# Altium project TIDA_00620.PrjPcb (part 5 of 8)
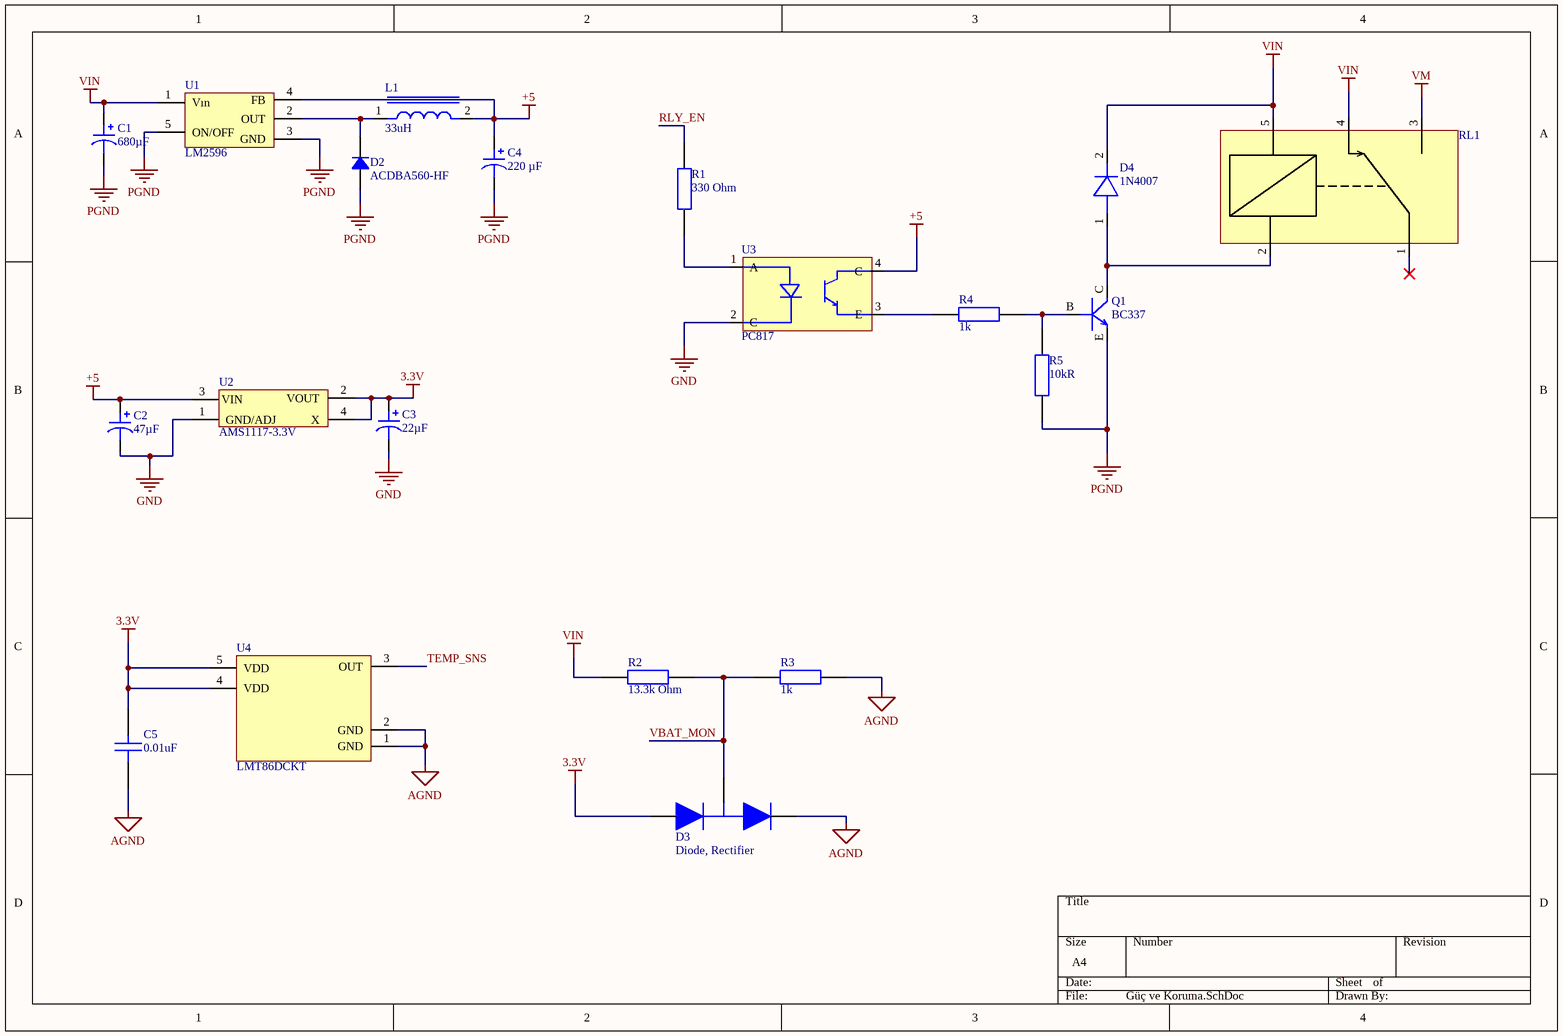
[diagram p8: Güç ve Koruma.SchDoc]

## Sheet Güç ve Koruma.SchDoc (continued)

### Library data of the parts (continued)
R3 R4 = CRCW04021K00FKED: Res Thick Film 0402 1K Ohm 1% 1/16W ±100ppm/°C Molded SMD Paper T/R; Manufacturer: Vishay; Max Power Dissipation: 63mW; Value: 1kΩ; Voltage Rating: 50V; Supplier: Farnell; Supplier Part Number: 1469662; Manufacturer Part Number: CRCW04021K00FKED; RoHS: Compliant; Category: Chip SMD Resistors; Stock: 8230851; Pricing: 10=0,0156, 100=0,0087, 500=0,0081, 2500=0,0074, 5000=0,0058, 10000=0,0038 (EUR); Case/Package: 0402; Case Code (Imperial): 0402; China RoHS: Non-Compliant; Composition: Thick Film; Contact Plating: Tin; Depth: 500µm; Features: Automotive AEC-Q200; Height: 350µm; Lead Free: Lead Free; Length: 1mm; Lifecycle Status: Production; Max Operating Temperature: 155°C; Military Standard: Not; Min Operating Temperature: -55°C; Mounting Technology: Surface Mount; Pins: 2; Number of Terminals: 2; Number of Terminations: 2; Packaging: Cut Tape; Power Dissipation: 63mW; Power Rating: 63mW; Radiation Hardening: No; REACH SVHC: Yes; Schedule B: 8533210045, 8533210045|8533210045, 8533210045|8533210045|8533210045, 8533210045|8533210045|8533210045|8533210045; Temperature Coefficient: 100ppm/°C; Termination: SMD/SMT; Tolerance: 1%; Voltage Rating (DC): 50V; Weight: 652.039032µg; Width: 500µm; Working Voltage: 50V; ComponentLink1URL: https://datasheet.octopart.com:443/CRCW04021K00FKED-Vishay-datasheet-175423584.pdf?src-supplier=IHS; ComponentLink1Description: https://datasheet.octopart.com:443/CRCW04021K00FKED-Vishay-datasheet-175423584.pdf?src-supplier=IHS; ComponentLink2URL: https://datasheet.octopart.com:443/CRCW04021K00FKED-Vishay-datasheet-83961561.pdf?src-supplier=Newark; ComponentLink2Description: https://datasheet.octopart.com:443/CRCW04021K00FKED-Vishay-datasheet-83961561.pdf?src-supplier=Newark; ComponentLink3URL: https://datasheet.octopart.com:443/CRCW04021K00FKED-Vishay-datasheet-11516975.pdf?src-supplier=Newark; ComponentLink3Description: https://datasheet.octopart.com:443/CRCW04021K00FKED-Vishay-datasheet-11516975.pdf?src-supplier=Newark; ComponentLink4URL: https://datasheet.octopart.com:443/CRCW04021K00FKED-Vishay-datasheet-183883877.pdf?src-supplier=Newark; ComponentLink4Description: https://datasheet.octopart.com:443/CRCW04021K00FKED-Vishay-datasheet-183883877.pdf?src-supplier=Newark; ComponentLink5URL: https://datasheet.octopart.com:443/CRCW04021K00FKED-Vishay-datasheet-41302739.pdf?src-supplier=Newark; ComponentLink5Description: https://datasheet.octopart.com:443/CRCW04021K00FKED-Vishay-datasheet-41302739.pdf?src-supplier=Newark; ComponentLink6URL: https://datasheet.octopart.com:443/CRCW04021K00FKED-Vishay-datasheet-66077789.pdf?src-supplier=element14+APAC; ComponentLink6Description: https://datasheet.octopart.com:443/CRCW04021K00FKED-Vishay-datasheet-66077789.pdf?src-supplier=element14+APAC; ComponentLink7URL: https://datasheet.octopart.com:443/CRCW04021K00FKED-Vishay-datasheet-62317933.pdf?src-supplier=element14+APAC; ComponentLink7Description: https://datasheet.octopart.com:443/CRCW04021K00FKED-Vishay-datasheet-62317933.pdf?src-supplier=element14+APAC; ComponentLink8URL: https://datasheet.octopart.com:443/CRCW04021K00FKED-Vishay-datasheet-14722531.pdf?src-supplier=element14+APAC; ComponentLink8Description: https://datasheet.octopart.com:443/CRCW04021K00FKED-Vishay-datasheet-14722531.pdf?src-supplier=element14+APAC; ComponentLink9URL: https://datasheet.octopart.com:443/CRCW04021K00FKED.-Vishay-datasheet-78776209.pdf?src-supplier=element14+APAC; ComponentLink9Description: https://datasheet.octopart.com:443/CRCW04021K00FKED.-Vishay-datasheet-78776209.pdf?src-supplier=element14+APAC; ComponentLink10URL: https://datasheet.octopart.com:443/CRCW04021K00FKED-Vishay-datasheet-5300368.pdf?src-supplier=Future+Electronics; ComponentLink10Description: https://datasheet.octopart.com:443/CRCW04021K00FKED-Vishay-datasheet-5300368.pdf?src-supplier=Future+Electronics; ComponentLink11URL: https://datasheet.octopart.com:443/CRCW04021K00FKED-Vishay-datasheet-62316122.pdf?src-supplier=Future+Electronics; ComponentLink11Description: https://datasheet.octopart.com:443/CRCW04021K00FKED-Vishay-datasheet-62316122.pdf?src-supplier=Future+Electronics; ComponentLink12URL: https://datasheet.octopart.com:443/CRCW04021K00FKED-Vishay-datasheet-5306405.pdf?src-supplier=RS+(Formerly+Allied+Electronics); ComponentLink12Description: https://datasheet.octopart.com:443/CRCW04021K00FKED-Vishay-datasheet-5306405.pdf?src-supplier=RS+(Formerly+Allied+Electronics); ComponentLink13URL: https://datasheet.octopart.com:443/CRCW04021K00FKED-Vishay-Dale-datasheet-47688880.pdf?src-supplier=RS+(Formerly+Allied+Electronics); ComponentLink13Description: https://datasheet.octopart.com:443/CRCW04021K00FKED-Vishay-Dale-datasheet-47688880.pdf?src-supplier=RS+(Formerly+Allied+Electronics); ComponentLink14URL: https://datasheet.octopart.com:443/CRCW04021K00FKED-Vishay-datasheet-12001583.pdf?src-supplier=RS+(Formerly+Allied+Electronics); ComponentLink14Description: https://datasheet.octopart.com:443/CRCW04021K00FKED-Vishay-datasheet-12001583.pdf?src-supplier=RS+(Formerly+Allied+Electronics); ComponentLink15URL: https://datasheet.octopart.com:443/CRCW04021K00FKED-Vishay-datasheet-62332075.pdf?src-supplier=TME; ComponentLink15Description: https://datasheet.octopart.com:443/CRCW04021K00FKED-Vishay-datasheet-62332075.pdf?src-supplier=TME; ComponentLink16URL: https://datasheet.octopart.com:443/CRCW04021K00FKED-Vishay-datasheet-13242068.pdf?src-supplier=Farnell; ComponentLink16Description: https://datasheet.octopart.com:443/CRCW04021K00FKED-Vishay-datasheet-13242068.pdf?src-supplier=Farnell; ComponentLink17URL: https://datasheet.octopart.com:443/CRCW04021K00FKED-Vishay-datasheet-13195083.pdf?src-supplier=Farnell; ComponentLink17Description: https://datasheet.octopart.com:443/CRCW04021K00FKED-Vishay-datasheet-13195083.pdf?src-supplier=Farnell; ComponentLink18URL: https://datasheet.octopart.com:443/CRCW04021K00FKED-Vishay-datasheet-13034211.pdf?src-supplier=Farnell; ComponentLink18Description: https://datasheet.octopart.com:443/CRCW04021K00FKED-Vishay-datasheet-13034211.pdf?src-supplier=Farnell; ComponentLink19URL: https://datasheet.octopart.com:443/CRCW04021K00FKED-Vishay-datasheet-12600034.pdf?src-supplier=Farnell; ComponentLink19Description: https://datasheet.octopart.com:443/CRCW04021K00FKED-Vishay-datasheet-12600034.pdf?src-supplier=Farnell; ComponentLink20URL: https://datasheet.octopart.com:443/CRCW04021K00FKED-Vishay-datasheet-12532161.pdf?src-supplier=Farnell; ComponentLink20Description: https://datasheet.octopart.com:443/CRCW04021K00FKED-Vishay-datasheet-12532161.pdf?src-supplier=Farnell; ComponentLink21URL: https://datasheet.octopart.com:443/CRCW04021K00FKED-Vishay-datasheet-12517896.pdf?src-supplier=Farnell; ComponentLink21Description: https://datasheet.octopart.com:443/CRCW04021K00FKED-Vishay-datasheet-12517896.pdf?src-supplier=Farnell; ComponentLink22URL: https://datasheet.octopart.com:443/CRCW04021K00FKED-Vishay-datasheet-12509762.pdf?src-supplier=Farnell; ComponentLink22Description: https://datasheet.octopart.com:443/CRCW04021K00FKED-Vishay-datasheet-12509762.pdf?src-supplier=Farnell; ComponentLink23URL: https://datasheet.octopart.com:443/CRCW04021K00FKED-Vishay-datasheet-10322335.pdf?src-supplier=Farnell; ComponentLink23Description: https://datasheet.octopart.com:443/CRCW04021K00FKED-Vishay-datasheet-10322335.pdf?src-supplier=Farnell; ComponentLink24URL: https://datasheet.octopart.com:443/CRCW04021K00FKED-Vishay-datasheet-8788789.pdf?src-supplier=Farnell; ComponentLink24Description: https://datasheet.octopart.com:443/CRCW04021K00FKED-Vishay-datasheet-8788789.pdf?src-supplier=Farnell; ComponentLink25URL: https://datasheet.octopart.com:443/CRCW04021K00FKED-Vishay-datasheet-8361388.pdf?src-supplier=Farnell; ComponentLink25Description: https://datasheet.octopart.com:443/CRCW04021K00FKED-Vishay-datasheet-8361388.pdf?src-supplier=Farnell; ComponentLink26URL: https://datasheet.octopart.com:443/CRCW04021K00FKED-Vishay-datasheet-546287.pdf?src-supplier=Farnell; ComponentLink26Description: https://datasheet.octopart.com:443/CRCW04021K00FKED-Vishay-datasheet-546287.pdf?src-supplier=Farnell; ComponentLink27URL: https://datasheet.octopart.com:443/CRCW04021K00FKED-Vishay-datasheet-11540273.pdf?src-supplier=Arrow+Electronics; ComponentLink27Description: https://datasheet.octopart.com:443/CRCW04021K00FKED-Vishay-datasheet-11540273.pdf?src-supplier=Arrow+Electronics; ComponentLink28URL: https://datasheet.octopart.com:443/CRCW04021K00FKED-Vishay-datasheet-8445837.pdf?src-supplier=element14; ComponentLink28Description: https://datasheet.octopart.com:443/CRCW04021K00FKED-Vishay-datasheet-8445837.pdf?src-supplier=element14; ComponentLink29URL: https://datasheet.octopart.com:443/CRCW04021K00FKED-Vishay-datasheet-5377255.pdf?src-supplier=Garrett; ComponentLink29Description: https://datasheet.octopart.com:443/CRCW04021K00FKED-Vishay-datasheet-5377255.pdf?src-supplier=Garrett; ComponentLink30URL: https://datasheet.octopart.com:443/CRCW04021K00FKED-Vishay-datasheet-148188.pdf?src-supplier=Garrett; ComponentLink30Description: https://datasheet.octopart.com:443/CRCW04021K00FKED-Vishay-datasheet-148188.pdf?src-supplier=Garrett; ComponentLink31URL: https://datasheet.octopart.com:443/CRCW04021K00FKED-Vishay-datasheet-42367.pdf?src-supplier=Garrett; ComponentLink31Description: https://datasheet.octopart.com:443/CRCW04021K00FKED-Vishay-datasheet-42367.pdf?src-supplier=Garrett; ComponentLink32URL: http://sigma.octopart.com:80/rohs_statement/Vishay-company-15.pdf?src-supplier=Compliance+Statements; ComponentLink32Description: http://sigma.octopart.com:80/rohs_statement/Vishay-company-15.pdf?src-supplier=Compliance+Statements
R5 = RES 10K OHM 0603: RES 10K %1 OHM 0603 SMD; Manufacturer: Yageo; Designed by: BERK; Tolerance: 1%; Temperature Coefficient: 100ppm/°C; Voltage Rating (DC): 50V; Power Rating: 100mW; Voltage Rating: 75V; Supplier 1: Digi-Key; Manufacturer Part Number: RC0603FR-0710KL; RoHS: Yes; Category: Chip SMD Resistors; Stock 1: 24140601; Pricing 1: 1=0,10000, 10=0,02300, 100=0,00930, 1000=0,00417, 2500=0,00362 (USD); Case/Package: 0603; Number of Pins: 2; Case Code (Imperial): 0603; Case Code (Metric): 1608; Weight: 7.1E-05oz; Size Code: 0603; Min Operating Temperature: -55°C; Max Operating Temperature: 155°C; Resistor Type: Thick Film; Packaging: Tape and Reel; Termination: SMD/SMT; Features: Moisture Resistant; Series: RC; Max Power Dissipation: 100mW; Number of Terminations: 2; Resistance Tolerance: 1%; Construction: Rectangular; Length: 1.6mm; Width: 0.8mm; Height: 0.45mm; Depth: 0.8mm; Lead Pitch: 0.3mm; REACH SVHC: Unknown; Lead Free: Lead Free; Military Standard: Not; RoHS Compliant: Yes; ComponentLink1URL: https://datasheet.ciiva.com/7660/38590-7660789.pdf?src-supplier=Element14; ComponentLink1Description: https://datasheet.ciiva.com/7660/38590-7660789.pdf?src-supplier=Element14; ComponentLink2URL: https://datasheet.ciiva.com/15189/getdatasheetpartid-409289-15189591.pdf?src-supplier=Verical; ComponentLink2Description: https://datasheet.ciiva.com/15189/getdatasheetpartid-409289-15189591.pdf?src-supplier=Verical; ComponentLink3URL: https://datasheet.ciiva.com/46440/1868787-46440891.pdf?src-supplier=Element14; ComponentLink3Description: https://datasheet.ciiva.com/46440/1868787-46440891.pdf?src-supplier=Element14; ComponentLink4URL: https://datasheet.ciiva.com/7983/443971-7983596.pdf?src-supplier=Element14; ComponentLink4Description: https://datasheet.ciiva.com/7983/443971-7983596.pdf?src-supplier=Element14; ComponentLink5URL: https://datasheet.ciiva.com/7746/1738695-7746239.pdf?src-supplier=Element14; ComponentLink5Description: https://datasheet.ciiva.com/7746/1738695-7746239.pdf?src-supplier=Element14; ComponentLink6URL: https://datasheet.ciiva.com/22747/443971-22747519.pdf?src-supplier=Element14; ComponentLink6Description: https://datasheet.ciiva.com/22747/443971-22747519.pdf?src-supplier=Element14; Supplier Part Number 1: 311-10.0KHRCT-ND
RL1 = HK15F-DC24V-S-K: 24V 30A Amperli T Röle HK15F-DC24V-S-K
U1 = LM2596: Conv DC-DC 4.5V to 40V Step Down Single-Out 1.23V to 37V 3A 6-Pin(5+Tab) D2PAK Tube; Manufacturer: onsemi; Manufacturer Part Number: LM2596DSADJG; Manufacturer Lifecycle Status: ACTIVE; Efficiency: 73%; Max Duty Cycle: 95%; Max Junction Temperature (Tj): 125°C; Max Output current: 7.5A; Max Switching Frequency: 180kHz; Nominal Supply Voltage: 12V; Nominal Output Voltage: 5V; Nominal Supply Current: 5mA; Number of Channels: 1; Output Type: Adjustable; Switching Frequency: 150Hz; Synchronous Rectifier: No; Topology: Buck; Supplier: Farnell; Supplier Part Number: 2534162; RoHS: Compliant; Category: Voltage Regulators - Switching; Stock: 7042; Pricing: 1=2,23, 10=1,74, 50=1,46, 100=1,4, 250=1,26, 500=1,24, 1000=1,22, 2500=1,18 (EUR); Case/Package: D2PAK; China RoHS: Non-Compliant; Contact Plating: Tin; Halogen Free: Halogen Free; Height: 4.826mm; Lead Free: Lead Free; Length: 10.02mm; Lifecycle Status: Production; Max Supply Voltage: 40V; Max Operating Temperature: 125°C; Max Output Voltage: 37V; Min Input Voltage: 4.5V; Min Operating Temperature: -40°C; Min Output Voltage: 1.23V; Min Supply Voltage: 4.5V; Mounting Technology: Surface Mount; Number of Circuits: 1; Number of Outputs: 1; Pins: 5; Number of Terminals: 5; Operating Supply Voltage: 40V; Output Current: 3A; Output Voltage: 37V; Radiation Hardening: No; REACH SVHC: No; Schedule B: 8542390000, 8542390000|8542390000|8542390000|8542390000|8542390000; Terminal Pitch: 1.702mm; Width: 9.1945mm; ComponentLink1URL: https://datasheet.octopart.com:443/LM2596DSADJG-ON-Semiconductor-datasheet-11796857.pdf?src-supplier=JRH+Electronics; ComponentLink1Description: https://datasheet.octopart.com:443/LM2596DSADJG-ON-Semiconductor-datasheet-11796857.pdf?src-supplier=JRH+Electronics; ComponentLink2URL: https://datasheet.octopart.com:443/LM2596DSADJG-onsemi-datasheet-180961345.pdf?src-supplier=Farnell; ComponentLink2Description: https://datasheet.octopart.com:443/LM2596DSADJG-onsemi-datasheet-180961345.pdf?src-supplier=Farnell; ComponentLink3URL: https://sigma.octopart.com:443/138898132/technical_drawing/ON-Semiconductor-LM2596DSADJG.pdf?src-supplier=Upverter; ComponentLink3Description: https://sigma.octopart.com:443/138898132/technical_drawing/ON-Semiconductor-LM2596DSADJG.pdf?src-supplier=Upverter; ComponentLink4URL: https://datasheet.octopart.com:443/LM2596DSADJG-ON-Semiconductor-datasheet-62289847.pdf?src-supplier=element14+APAC; ComponentLink4Description: https://datasheet.octopart.com:443/LM2596DSADJG-ON-Semiconductor-datasheet-62289847.pdf?src-supplier=element14+APAC; ComponentLink5URL: https://datasheet.octopart.com:443/LM2596DSADJG-ON-Semiconductor-datasheet-130255974.pdf?src-supplier=TME; ComponentLink5Description: https://datasheet.octopart.com:443/LM2596DSADJG-ON-Semiconductor-datasheet-130255974.pdf?src-supplier=TME; ComponentLink6URL: https://datasheet.octopart.com:443/LM2596DSADJG-ON-Semiconductor-datasheet-41764107.pdf?src-supplier=RS+(Formerly+Allied+Electronics); ComponentLink6Description: https://datasheet.octopart.com:443/LM2596DSADJG-ON-Semiconductor-datasheet-41764107.pdf?src-supplier=RS+(Formerly+Allied+Electronics); ComponentLink7URL: http://sigma.octopart.com:80/15540786/rohs_certificate/ON-Semiconductor-LM2596DSADJG.pdf?src-supplier=Compliance+Statements; ComponentLink7Description: http://sigma.octopart.com:80/15540786/rohs_certificate/ON-Semiconductor-LM2596DSADJG.pdf?src-supplier=Compliance+Statements; ComponentLink8URL: http://sigma.octopart.com:80/15676848/materials_sheet/ON-Semiconductor-LM2596DSADJG.csv?src-supplier=Compliance+Statements; ComponentLink8Description: http://sigma.octopart.com:80/15676848/materials_sheet/ON-Semiconductor-LM2596DSADJG.csv?src-supplier=Compliance+Statements; ComponentLink9URL: http://sigma.octopart.com:80/150613181/rohs_statement/ON-Semiconductor-LM2596DSADJG.pdf?src-supplier=Compliance+Statements; ComponentLink9Description: http://sigma.octopart.com:80/150613181/rohs_statement/ON-Semiconductor-LM2596DSADJG.pdf?src-supplier=Compliance+Statements; ComponentLink10URL: http://sigma.octopart.com:80/reach_statement/ON-Semiconductor-company-79.pdf?src-supplier=Compliance+Statements; ComponentLink10Description: http://sigma.octopart.com:80/reach_statement/ON-Semiconductor-company-79.pdf?src-supplier=Compliance+Statements; ComponentLink11URL: https://octopart.com:443/opatz8j6/c1?t=oT4azNMBCRdNr4JB2es6ib24tMsaAQUbmMEJXGIb7MTKDbdgd3KKbfJR36CtWkgzryCe2qI11MR_nrhpaW3ZGFx62WySwDlBob3uoPAUucWHklYx0BaMJ_-iQ0FVxO1J7T1_lBmpr6Xa-RwUeyt-289S9K0kgAiDjFPfrYNjZ-7HUJXsVaPSLe6623QdEXGrn5ut6XGXdlM2XAV6LQCO9fcg-V1bvlb77HZ5dQI5txPPGBwKzQ-O_MvKaygEutqLX-m_VvBPVeFhc-eIqmBYap3x8SR8Us1Mdzu7U--B1WHN_ktKy_7Cpts17e9YaRHt96YZwqNpnI4vxPPbibjTIaO5tOBQVudy7bRTr0uOrn0&src-supplier=Compliance+Statements; ComponentLink11Description: https://octopart.com:443/opatz8j6/c1?t=oT4azNMBCRdNr4JB2es6ib24tMsaAQUbmMEJXGIb7MTKDbdgd3KKbfJR36CtWkgzryCe2qI11MR_nrhpaW3ZGFx62WySwDlBob3uoPAUucWHklYx0BaMJ_-iQ0FVxO1J7T1_lBmpr6Xa-RwUeyt-289S9K0kgAiDjFPfrYNjZ-7HUJXsVaPSLe6623QdEXGrn5ut6XGXdlM2XAV6LQCO9fcg-V1bvlb77HZ5dQI5txPPGBwKzQ-O_MvKaygEutqLX-m_VvBPVeFhc-eIqmBYap3x8SR8Us1Mdzu7U--B1WHN_ktKy_7Cpts17e9YaRHt96YZwqNpnI4vxPPbibjTIaO5tOBQVudy7bRTr0uOrn0&src-supplier=Compliance+Statements; ComponentLink12URL: https://octopart.com:443/opatz8j6/c1?t=Dg2TvkwHK56choIH4o1UeiJEbNHaQuOp4jXveqQ-QKgJvRtRpJDRB4WzsWQQe-X1Yn940rt-yMOdkVo9dLItVNRkZsEPflQAfOoSTh_i3W12TKwdTZggiVL5GhB3g0xAvn-cbksnNXbkP3Y1q5okPlQdUk_tuihM5cOUhOlv_D7nNvDg6i35cMc6102nZhEEe-vjBEPf2fOSvnAmys-NC5C3iuqjw6pZ3_Mt5xXK8OYTznpIyE5gNPlnpx207o-CJtnQrTeg-O7-8ZlG_TIdoFmJeJJnOVqfmMBVC_6LU1whf0jybcgkVv2AXQSl74opr3FjWrT99UyS1IpWb1sY9hqrV4xjhbo9eZQmjD3Ziw&src-supplier=Compliance+Statements; ComponentLink12Description: https://octopart.com:443/opatz8j6/c1?t=Dg2TvkwHK56choIH4o1UeiJEbNHaQuOp4jXveqQ-QKgJvRtRpJDRB4WzsWQQe-X1Yn940rt-yMOdkVo9dLItVNRkZsEPflQAfOoSTh_i3W12TKwdTZggiVL5GhB3g0xAvn-cbksnNXbkP3Y1q5okPlQdUk_tuihM5cOUhOlv_D7nNvDg6i35cMc6102nZhEEe-vjBEPf2fOSvnAmys-NC5C3iuqjw6pZ3_Mt5xXK8OYTznpIyE5gNPlnpx207o-CJtnQrTeg-O7-8ZlG_TIdoFmJeJJnOVqfmMBVC_6LU1whf0jybcgkVv2AXQSl74opr3FjWrT99UyS1IpWb1sY9hqrV4xjhbo9eZQmjD3Ziw&src-supplier=Compliance+Statements
U3 = PC817: Optocoupler DC-IN 1-CH Transistor DC-OUT 4-Pin PDIP Sleeve; Manufacturer: Sharp; Manufacturer Part Number: PC817X1J000F; Collector Emitter Breakdown Voltage: 80V; Collector Emitter Saturation Voltage: 200mV; Current Transfer Ratio: 80%; Dark Current: 100nA; Fall Time: 18µs; Forward Current: 50mA; Forward Voltage: 1.2V; Input Current: 20mA; Isolation Voltage: 5kV; Max Power Dissipation: 200mW; Number of Channels: 1; Reverse Breakdown Voltage: 6V; Supplier: Farnell; Supplier Part Number: 9707697; RoHS: Compliant; Category: Optocouplers; Pricing: 1=0,92, 25=0,49, 100=0,33, 250=0,28, 500=0,24, 1000=0,21, 3000=0,191, 10000=0,171 (EUR); Case/Package: DIP; Collector Emitter Voltage (VCEO): 80V; Height: 4.5mm; Lead Free: Lead Free; Lifecycle Status: Obsolete; Max Collector Current: 50mA; Max Input Current: 50mA; Max Operating Temperature: 100°C; Min Operating Temperature: -30°C; Mounting Technology: Through Hole; Number of Elements: 1; Pins: 4; Output Current per Channel: 50mA; Output Voltage: 80V; Power Dissipation: 200mW; Radiation Hardening: No; REACH SVHC: Yes; Reverse Voltage: 6V; Rise Time: 18µs; Width: 6.5mm; ComponentLink1URL: https://datasheet.octopart.com:443/PC817X1J000F-Sharp-datasheet-162829.pdf?src-supplier=element14+APAC; ComponentLink1Description: https://datasheet.octopart.com:443/PC817X1J000F-Sharp-datasheet-162829.pdf?src-supplier=element14+APAC; ComponentLink2URL: https://datasheet.octopart.com:443/PC817X1J000F-Sharp-datasheet-180744121.pdf?src-supplier=IHS; ComponentLink2Description: https://datasheet.octopart.com:443/PC817X1J000F-Sharp-datasheet-180744121.pdf?src-supplier=IHS; ComponentLink3URL: https://datasheet.octopart.com:443/PC817X1J000F-Sharp-Microelectronics-datasheet-123893.pdf?src-supplier=DigiKey; ComponentLink3Description: https://datasheet.octopart.com:443/PC817X1J000F-Sharp-Microelectronics-datasheet-123893.pdf?src-supplier=DigiKey
U4 = LMT86DCKT: 2.2V-Capable, 10 uA Analog Output Temperature Sensor in SC70 and TO-92 5-SC70 -50 to 150; Manufacturer: Texas Instruments; Manufacturer Lifecycle Status: OBSOLETE; Max Junction Temperature (Tj): 150°C; Max Supply Voltage: 5.5V; Min Supply Voltage: 2.2V; Nominal Supply Current: 5.4µA; Output Current: 7mA; Output Voltage: 150mV; Supplier: Mouser; Supplier Part Number: 595-LMT86DCKT; Manufacturer Part Number: LMT86DCKT; RoHS: Compliant; Category: Temperature and Humidity Sensors; Stock: 14953; Pricing: 1=1,05, 10=0,822, 50=0,784, 100=0,709, 1000=0,635, 10000=0,596 (USD); Ambient Temperature Range High: 150°C; Case/Package: SC; Height: 1.1mm; Interface: Analog; Lead Free: Lead Free; Length: 2mm; Lifecycle Status: Obsolete; Max Operating Temperature: 150°C; Min Operating Temperature: -50°C; Mounting Technology: Surface Mount; Pins: 5; Operating Supply Current: 5.4µA; Output Type: ANALOG; Packaging: Cut Tape; Quiescent Current: 5.4µA; Radiation Hardening: No; REACH SVHC: No; Schedule B: 8542390000, 8542390000|8542390000|8542390000|8542390000|8542390000; Thickness: 900µm; Width: 1.25mm; ComponentLink1URL: https://sigma.octopart.com:443/182282879/technical_drawing/Texas-Instruments-LMT86DCKT.pdf?src-supplier=Texas+Instruments; ComponentLink1Description: https://sigma.octopart.com:443/182282879/technical_drawing/Texas-Instruments-LMT86DCKT.pdf?src-supplier=Texas+Instruments; ComponentLink2URL: https://octopart.com:443/opatz8j6/c1?t=9HQWOq9vND9b112XOORCH9Vsw1tDULado_71xZVJD5NCDKKbo5Ghebw2v1WkowqZDmkFyXd3CdhKpSqCk7PtQOQ7x-G2JpCPf_WjxdC5NMg5jKfyra5aiwnhNPwQhaItqLqfVAzBzWTS-c0ov57vA77sSY7z2rAPniNTZvNDKUMZfXkGbrAzWQCv1qZrHSDSg3qjKiyU7_eC7562E4E85R2VNSwCtGeJJLgAb4JoBUkX8cOn-YW7xKv7mq24ixEkLrSvCint_SPV1kOoFa0e-FYBvRA-X5e5sItaWLcgSJ4jRxFhImzPQgymLOz7X93vKvNF5nr-spi1A9my05NiWkr-vMM4xm9RJAmqZ0e4SRFjq62_Iov__ZokAK-EkgB-HL_1&src-supplier=Texas+Instruments; ComponentLink2Description: https://octopart.com:443/opatz8j6/c1?t=9HQWOq9vND9b112XOORCH9Vsw1tDULado_71xZVJD5NCDKKbo5Ghebw2v1WkowqZDmkFyXd3CdhKpSqCk7PtQOQ7x-G2JpCPf_WjxdC5NMg5jKfyra5aiwnhNPwQhaItqLqfVAzBzWTS-c0ov57vA77sSY7z2rAPniNTZvNDKUMZfXkGbrAzWQCv1qZrHSDSg3qjKiyU7_eC7562E4E85R2VNSwCtGeJJLgAb4JoBUkX8cOn-YW7xKv7mq24ixEkLrSvCint_SPV1kOoFa0e-FYBvRA-X5e5sItaWLcgSJ4jRxFhImzPQgymLOz7X93vKvNF5nr-spi1A9my05NiWkr-vMM4xm9RJAmqZ0e4SRFjq62_Iov__ZokAK-EkgB-HL_1&src-supplier=Texas+Instruments; ComponentLink3URL: https://sigma.octopart.com:443/179129132/technical_drawing/Texas-Instruments-LMT86DCKT.pdf?src-supplier=Texas+Instruments; ComponentLink3Description: https://sigma.octopart.com:443/179129132/technical_drawing/Texas-Instruments-LMT86DCKT.pdf?src-supplier=Texas+Instruments; ComponentLink4URL: https://sigma.octopart.com:443/176385615/technical_drawing/Texas-Instruments-LMT86DCKT.pdf?src-supplier=Texas+Instruments; ComponentLink4Description: https://sigma.octopart.com:443/176385615/technical_drawing/Texas-Instruments-LMT86DCKT.pdf?src-supplier=Texas+Instruments; ComponentLink5URL: https://sigma.octopart.com:443/169406035/technical_drawing/Texas-Instruments-LMT86DCKT.pdf?src-supplier=Texas+Instruments; ComponentLink5Description: https://sigma.octopart.com:443/169406035/technical_drawing/Texas-Instruments-LMT86DCKT.pdf?src-supplier=Texas+Instruments; ComponentLink6URL: https://datasheet.octopart.com:443/LMT86DCKT-Texas-Instruments-datasheet-41216413.pdf?src-supplier=Texas+Instruments; ComponentLink6Description: https://datasheet.octopart.com:443/LMT86DCKT-Texas-Instruments-datasheet-41216413.pdf?src-supplier=Texas+Instruments; ComponentLink7URL: https://datasheet.octopart.com:443/LMT86DCKT-Texas-Instruments-datasheet-26524829.pdf?src-supplier=Texas+Instruments; ComponentLink7Description: https://datasheet.octopart.com:443/LMT86DCKT-Texas-Instruments-datasheet-26524829.pdf?src-supplier=Texas+Instruments; ComponentLink8URL: https://datasheet.octopart.com:443/LMT86DCKT-Texas-Instruments-datasheet-16054243.pdf?src-supplier=Texas+Instruments; ComponentLink8Description: https://datasheet.octopart.com:443/LMT86DCKT-Texas-Instruments-datasheet-16054243.pdf?src-supplier=Texas+Instruments; ComponentLink9URL: https://datasheet.octopart.com:443/LMT86DCKT-Texas-Instruments-datasheet-14434854.pdf?src-supplier=Texas+Instruments; ComponentLink9Description: https://datasheet.octopart.com:443/LMT86DCKT-Texas-Instruments-datasheet-14434854.pdf?src-supplier=Texas+Instruments; ComponentLink10URL: https://sigma.octopart.com:443/49249326/technical_drawing/Texas-Instruments-LMT86DCKT.pdf?src-supplier=Texas+Instruments; ComponentLink10Description: https://sigma.octopart.com:443/49249326/technical_drawing/Texas-Instruments-LMT86DCKT.pdf?src-supplier=Texas+Instruments; ComponentLink11URL: https://datasheet.octopart.com:443/LMT86DCKT-Texas-Instruments-datasheet-150945993.pdf?src-supplier=Upverter; ComponentLink11Description: https://datasheet.octopart.com:443/LMT86DCKT-Texas-Instruments-datasheet-150945993.pdf?src-supplier=Upverter; ComponentLink12URL: https://datasheet.octopart.com:443/LMT86DCKT-Texas-Instruments-datasheet-86781451.pdf?src-supplier=Farnell; ComponentLink12Description: https://datasheet.octopart.com:443/LMT86DCKT-Texas-Instruments-datasheet-86781451.pdf?src-supplier=Farnell; ComponentLink13URL: https://datasheet.octopart.com:443/LMT86DCKT-Texas-Instruments-datasheet-15501305.pdf?src-supplier=Newark; ComponentLink13Description: https://datasheet.octopart.com:443/LMT86DCKT-Texas-Instruments-datasheet-15501305.pdf?src-supplier=Newark; ComponentLink14URL: https://datasheet.octopart.com:443/LMT86DCKT-Texas-Instruments-datasheet-41204959.pdf?src-supplier=Newark; ComponentLink14Description: https://datasheet.octopart.com:443/LMT86DCKT-Texas-Instruments-datasheet-41204959.pdf?src-supplier=Newark; ComponentLink15URL: https://datasheet.octopart.com:443/LMT86DCKT-Texas-Instruments-datasheet-20674339.pdf?src-supplier=Newark; ComponentLink15Description: https://datasheet.octopart.com:443/LMT86DCKT-Texas-Instruments-datasheet-20674339.pdf?src-supplier=Newark; ComponentLink16URL: https://datasheet.octopart.com:443/LMT86DCKT-Texas-Instruments-datasheet-140571516.pdf?src-supplier=Arrow.cn; ComponentLink16Description: https://datasheet.octopart.com:443/LMT86DCKT-Texas-Instruments-datasheet-140571516.pdf?src-supplier=Arrow.cn; ComponentLink17URL: https://datasheet.octopart.com:443/LMT86DCKT-Texas-Instruments-datasheet-44401093.pdf?src-supplier=TME; ComponentLink17Description: https://datasheet.octopart.com:443/LMT86DCKT-Texas-Instruments-datasheet-44401093.pdf?src-supplier=TME; ComponentLink18URL: https://datasheet.octopart.com:443/LMT86DCKT-.-Texas-Instruments-datasheet-33010446.pdf?src-supplier=element14+APAC; ComponentLink18Description: https://datasheet.octopart.com:443/LMT86DCKT-.-Texas-Instruments-datasheet-33010446.pdf?src-supplier=element14+APAC; ComponentLink19URL: http://sigma.octopart.com:80/reach_statement/Texas-Instruments-company-64.pdf?src-supplier=Compliance+Statements; ComponentLink19Description: http://sigma.octopart.com:80/reach_statement/Texas-Instruments-company-64.pdf?src-supplier=Compliance+Statements; ComponentLink20URL: http://sigma.octopart.com:80/conflict_mineral_statement/Texas-Instruments-company-63.pdf?src-supplier=Compliance+Statements; ComponentLink20Description: http://sigma.octopart.com:80/conflict_mineral_statement/Texas-Instruments-company-63.pdf?src-supplier=Compliance+Statements

## Sheet Motor Driver.SchDoc
size A4; SheetNumber: 3; SheetTotal: 5
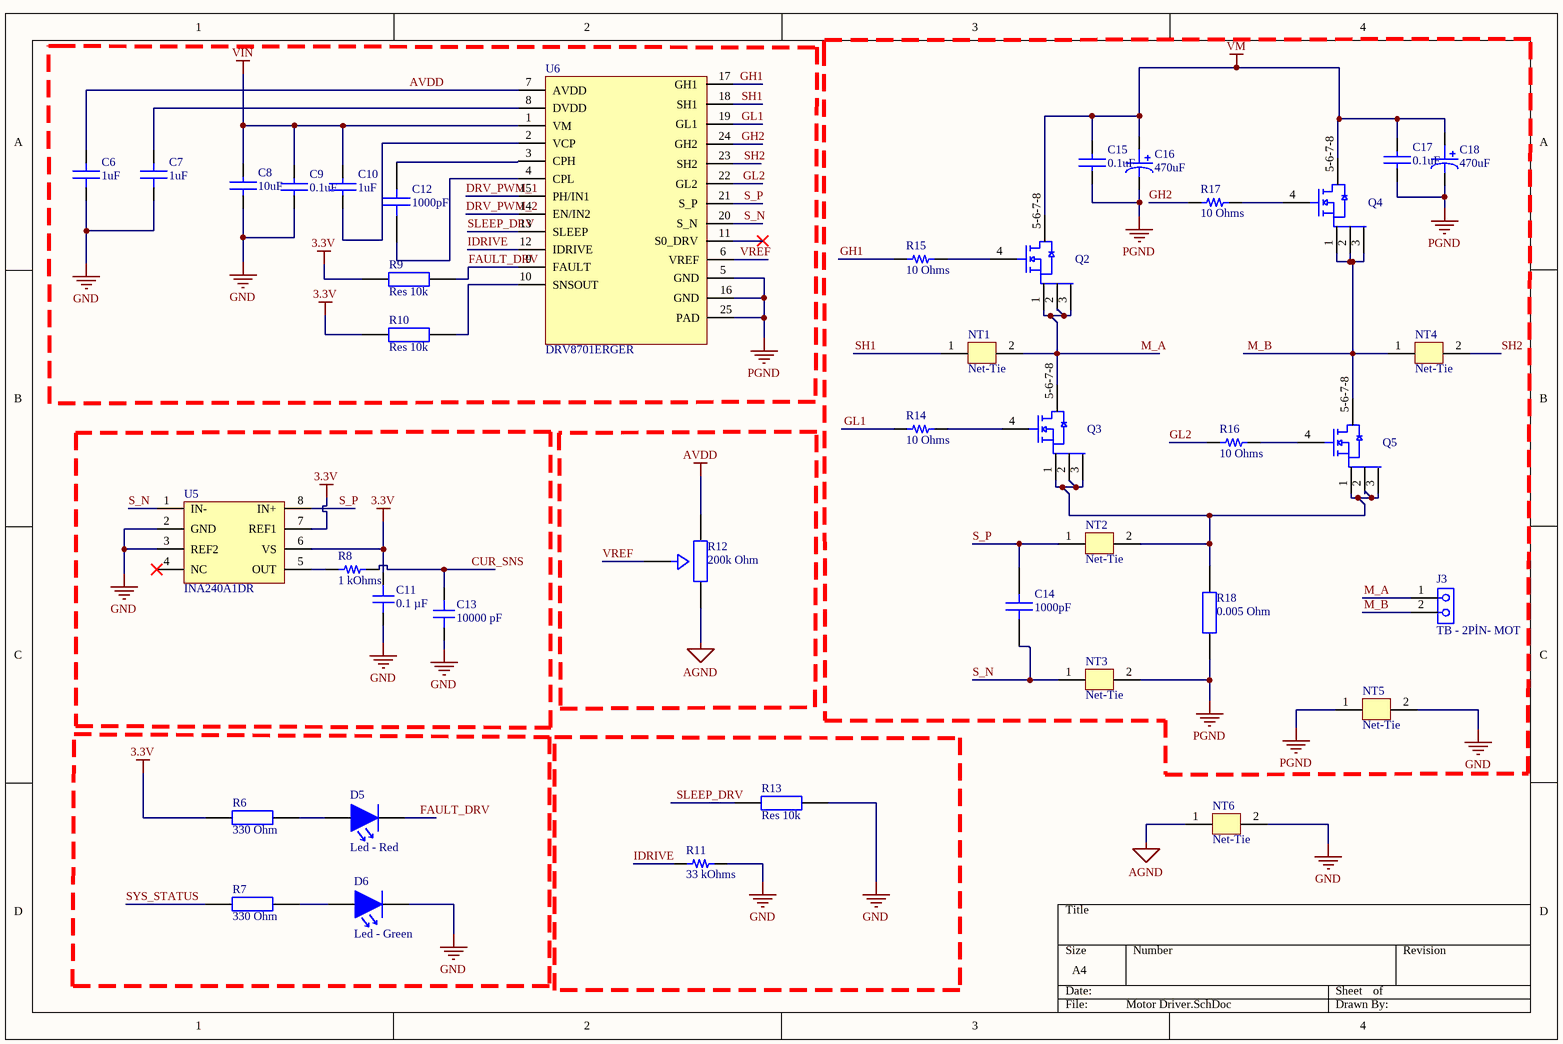
[diagram p2: Motor Driver.SchDoc]

### Parts
C6  1uF  [CAP0603-GRM188R60J105KA01D]
C7  1uF  [CAP0603-GRM188R60J105KA01D]
C8  10uF  [CAP1210- GRM32ER71H106KA12L]
C9  0.1uF  [CAP1206- GRM319R71H104KA01D]
C10  1uF  [CAP1206- GRM319R71C105KAA3D]
C11  0.1 µF  [CAP 0603_1608]
C12  1000pF  [CAP0402- GRM155R71C102KA01D]
C13  10000 pF  [CAP 0402_1005]
C14  1000pF  [CAP0402- GRM155R71C102KA01D]
C15  0.1uF  [CAP1206- GRM319R71H104KA01D]
C16  470uF  [RCAP, 8x20mm -EEU-FR1V471LB]
C17  0.1uF  [CAP1206- GRM319R71H104KA01D]
C18  470uF  [RCAP, 8x20mm -EEU-FR1V471LB]
D5  Led - Red  [LED_0805]
D6  Led - Green  [LED_0805]
J3  TB - 2PİN- MOT  [TB - 2PİN- MOT]
NT1  Net-Tie  [Net-Tie]  (net tie, no BOM)
NT2  Net-Tie  [Net-Tie]  (net tie, no BOM)
NT3  Net-Tie  [Net-Tie]  (net tie, no BOM)
NT4  Net-Tie  [Net-Tie]  (net tie, no BOM)
NT5  Net-Tie  [Net-Tie]  (net tie, no BOM)
NT6  Net-Tie  [Net-Tie]  (net tie, no BOM)
Q2  BSC010N04LSI  [SON 5X6]  (value not drawn)
Q3  BSC010N04LSI  [SON 5X6]  (value not drawn)
Q4  BSC010N04LSI  [SON 5X6]  (value not drawn)
Q5  BSC010N04LSI  [SON 5X6]  (value not drawn)
R6  330 Ohm  [RES0603- RC0603FR-07330RL]
R7  330 Ohm  [RES0603- RC0603FR-07330RL]
R8  1 kOhms  [RES 0603_1608]
R9  Res 10k  [RES0402 - ERJ-2RKF1002X]
R10  Res 10k  [RES0402 - ERJ-2RKF1002X]
R11  33 kOhms  [RES 1206_3216]
R12  200k Ohm  [3352P-1-204LF]
R13  Res 10k  [RES0402 - ERJ-2RKF1002X]
R14  10 Ohms  [RES 0805_2012]
R15  10 Ohms  [RES 0805_2012]
R16  10 Ohms  [RES 0805_2012]
R17  10 Ohms  [RES 0805_2012]
R18  0.005 Ohm  [KRL11050-C-R005-F-T1]
U5  INA240A1DR  [INA240A1DR]
U6  DRV8701ERGER  [DRV8701ERGER]

### Nets
3.3V: C11.2 R6.1 R9.1 R10.1 U5.6(VS) U5.7(REF1)
AGND: NT6.1 R12.3
AVDD: C6.2 R12.2 U6.7(AVDD)
GND: C6.1 C7.1 C8.1 C9.1 C11.1 C13.1 D6.1 NT5.2 NT6.2 R11.1 R13.2 U5.2(GND) U5.3(REF2)
PGND: C15.1 C16.N C17.1 C18.N NT3.2 NT5.1 R18.1 U6.5(GND) U6.16(GND) U6.25(PAD)
VIN: C8.2 C9.2 C10.2 U6.1(VM)
VM: C15.2 C16.P C17.2 C18.P Q2.5-6-7-8(D) Q4.5-6-7-8(D)
CUR_SNS: C13.2 R8.2
DRV_PWM_1: U6.15(PH/IN1)
DRV_PWM_2: U6.14(EN/IN2)
FAULT_DRV: D5.1 R9.2 U6.9(FAULT)
GH1: R15.1 U6.17(GH1)
GH2: R17.1 U6.24(GH2)
GL1: R14.1 U6.19(GL1)
GL2: R16.1 U6.22(GL2)
IDRIVE: R11.2 U6.12(IDRIVE)
M_A: J3.1 NT1.2 Q2.1(S) Q2.2(S) Q2.3(S) Q3.5-6-7-8(D)
M_B: J3.2 NT4.1 Q4.1(S) Q4.2(S) Q4.3(S) Q5.5-6-7-8(D)
S_N: C14.1 NT3.1 U5.1(IN-) U6.20(S_N)
S_P: C14.2 NT2.1 U5.8(IN+) U6.21(S_P)
SH1: NT1.1 U6.18(SH1)
SH2: NT4.2 U6.23(SH2)
SLEEP_DRV: R13.1 U6.13(SLEEP)
SYS_STATUS: R7.1
VREF: R12.1 U6.6(VREF)
NetC7_2: C7.2 U6.8(DVDD)
NetC10_1: C10.1 U6.2(VCP)
NetC12_1: C12.1 U6.4(CPL)
NetC12_2: C12.2 U6.3(CPH)
NetD5_2: D5.2 R6.2
NetD6_2: D6.2 R7.2
NetNT2_2: NT2.2 Q3.1(S) Q3.2(S) Q3.3(S) Q5.1(S) Q5.2(S) Q5.3(S) R18.2
NetQ2_4: Q2.4(G) R15.2
NetQ3_4: Q3.4(G) R14.2
NetQ4_4: Q4.4(G) R17.2
NetQ5_4: Q5.4(G) R16.2
NetR8_1: R8.1 U5.5(OUT)
NetR10_2: R10.2 U6.10(SNSOUT)

Not connected (* = marked no-connect by the designer): U5 4(NC)*; U6 11(S0_DRV)*